# EAGLE design charger (EAGLE 5.11)
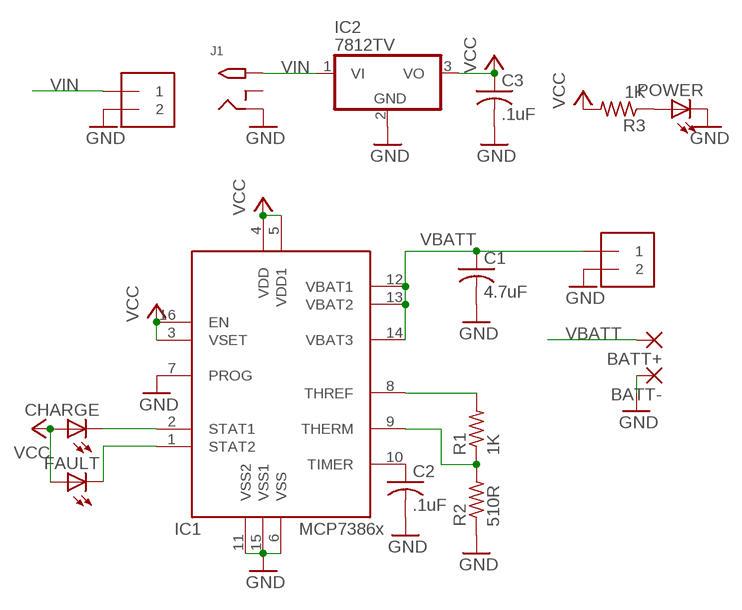
[diagram p0: schematic, sheet 1]

## Parts
BATT  1X2-3.5MM  [1X2-3.5MM]
BATT+  WIREPAD3,81/1,4  [3,81/1,4]
BATT-  WIREPAD3,81/1,4  [3,81/1,4]
C1  4.7uF  C-USC0805K  [C0805K]
C2  .1uF  C-USC0805K  [C0805K]
C3  .1uF  C-USC0805K  [C0805K]
CHARGE  LEDCHIPLED_0805  [CHIPLED_0805]
FAULT  LEDCHIPLED_0805  [CHIPLED_0805]
IC1  MCP7386XS  [SO16]
IC2  7812TV  [TO220V]
J1  2.1MMJACKTHM  [PJ-102A]
POWER  LEDCHIPLED_0805  [CHIPLED_0805]
PWR  1X2-3.5MM  [1X2-3.5MM]
R1  1K  R-US_R0805  [R0805]
R2  510R  R-US_R0805  [R0805]
R3  1K  R-US_R0805  [R0805]

## Nets
GND: BATT-.1(P) BATT.2 C1.2 C2.2 C3.2 IC1.6(VSS) IC1.7(PROG) IC1.11(VSS2) IC1.15(VSS1) IC2.2(GND) J1.RING POWER.C PWR.2 R2.1
N$1: CHARGE.C IC1.2(STAT1)
N$2: C2.1 IC1.10(TIMER)
N$3: FAULT.C IC1.1(STAT2)
N$5: IC1.9(THERM) R1.1 R2.2
N$6: IC1.8(THREF) R1.2
N$7: POWER.A R3.1
VBATT: BATT+.1(P) BATT.1 C1.1 IC1.12(VBAT1) IC1.13(VBAT2) IC1.14(VBAT3)
VCC: C3.1 CHARGE.A FAULT.A IC1.3(VSET) IC1.4(VDD) IC1.5(VDD1) IC1.16(EN) IC2.3(VO) R3.2
VIN: IC2.1(VI) J1.TIP PWR.1
Unconnected: J1.RING_SW

## Library data of the parts
BATT PWR = adafruit:1X2: 3.5mm Terminal block http://www.ladyada.net/library/pcb/eaglelibrary.html
BATT+ BATT- = wirepad:WIREPAD: Wire PAD connect wire on PCB
C1-C3 = adafruit:C-US: CAPACITOR, American symbol
CHARGE FAULT POWER = adafruit:LED: LED OSRAM: - CHIPLED LG R971, LG N971, LY N971, LG Q971, LY Q971, LO R971, LY R971 LH N974, LH R974 LS Q976, LO Q976, LY Q976 LO Q996 - Hyper CHIPLED LW Q18S LB Q993, LB Q99A, LB R99A - SideLED LS A670, LO A670, LY A670, LG A670, LP A670 LB A673, LV A673, LT A673, LW A673 LH A674 LY A675 LS A676, LA A676, LO A676, LY A676, LW A676 LS A679, LY A679, LG A679 - Hyper Micro SIDELED® LS Y876, LA Y876, LO Y876, LY Y876 LT Y87S - SmartLED LW L88C, LW L88S LB L89C, LB L89S, LG L890 LS L89K, LO L89K, LY L89K LS L896, LA L896, LO L896, LY L896 - TOPLED LS T670, LO T670, LY T670, LG T670, LP T670 LSG T670, LSP T670, LSY T670, LOP T670, LYG T670 LG T671, LOG T671, LSG T671 LB T673, LV T673, LT T673, LW T673 LH T674 LS T676, LA T676, LO T676, LY T676, LB T676, LH T676, LSB T676, LW T676 LB T67C, LV T67C, LT T67C, LS T67K, LO T67K, LY T67K, LW E67C LS E67B, LA E67B, LO E67B, LY E67B, LB E67C, LV E67C, LT E67C LW T67C LS T679, LY T679, LG T679 LS T770, LO T770, LY T770, LG T770, LP T770 LB T773, LV T773, LT T773, LW T773 LH T774 LS E675, LA E675, LY E675, LS T675 LS T776, LA T776, LO T776, LY T776, LB T776 LHGB T686 LT T68C, LB T68C - Hyper Mini TOPLED® LB M676 - Mini TOPLED Santana® LG M470 LS M47K, LO M47K, LY M47K Source: http://www.osram.convergy.de/
IC1 = adafruit:MCP7386X: MCP7386x 4.1, 4.2, 8.2, 8.4 LiPoly battery charger chip family, with wide DC input, thermal cutoff, adjustable curret, and indicator LEDs
IC2 = linear:78*: Positive VOLTAGE REGULATOR Source: http://cache.national.com/ds/LM/LM78L05.pdf http://www.fairchildsemi.com/ds/LM/LM7805.pdf
J1 = adafruit:2.1MMJACK: 2.1mm x 5.5mm THM DC jack with internal switch. Digikey part #PJ-102A, 4UCON part #05537 2.1mm x 5.5mm SMT DC jack with internal switch. Digikey part #PJ-002A-SMT, 4UCON part #03267 By microbuilder.eu & adafruit.com
R1-R3 = adafruit:R-US_: RESISTOR, American symbol

## Board
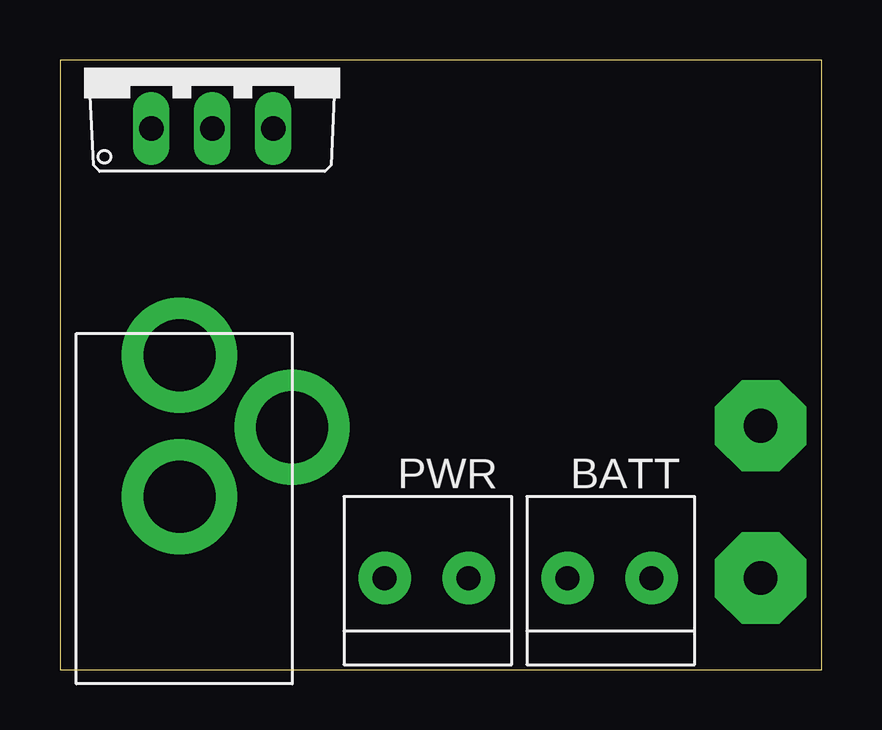
[diagram p1: board, top side]
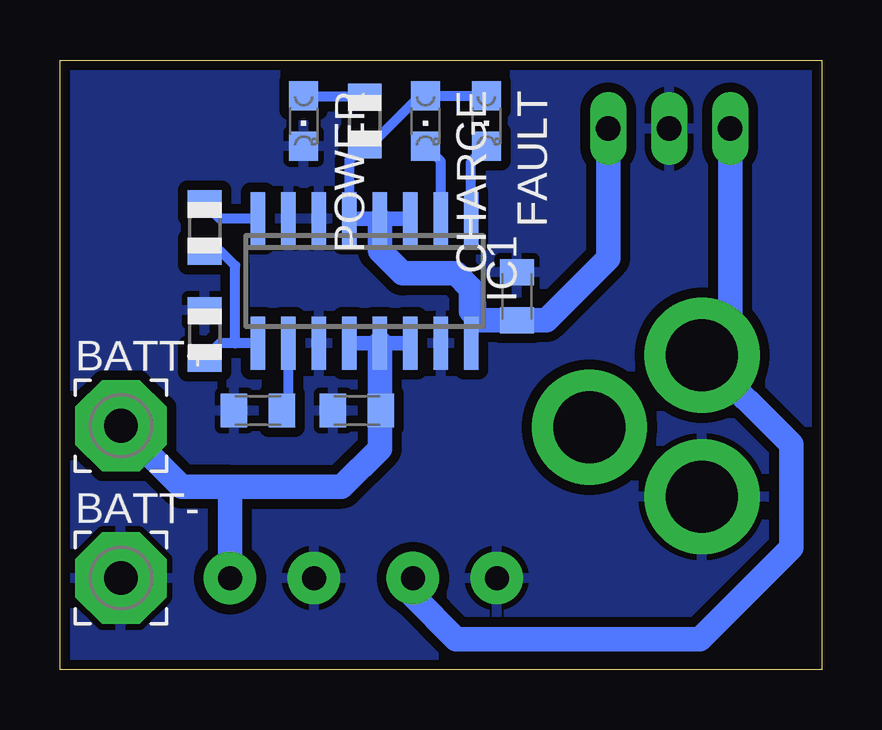
[diagram p2: board, bottom side, seen from below]

Size 31.75 x 25.4 mm. Coordinates in mm from the lower left corner, seen from the top.
Outline: 0,0 31.75,0 31.75,25.4 0,25.4 0,0
Copper layers (1*16): Top 0.035mm / dielectric 1.5mm / Bottom 0.035mm
Design rules "default": minimum track width 12mil, minimum drill 24mil, track to track 8mil, track to pad 8mil, pad to pad 8mil, via to via 8mil, smd to smd 8mil, copper to edge 15mil, drill to drill 8mil, minimum pad ring 10mil, minimum via ring 8mil, stop-mask expansion 4mil, vias tented up to drill 0mil, thermal gap 10mil

### Footprints (pad centres in the part's own frame; a part is rotated, then mirrored left to right if it is on the bottom)
1X2-3.5MM = drill 1 pad 2.184 round: 1 1.8,0; 2 -1.7,0
3,81/1,4 = drill 1.397 pad 3.81 octagon: 1 0,0
C0805K = smd 1.1 x 1.4: 1 -1,0; 2 1,0
CHIPLED_0805 = smd 1.2 x 1.2: A 0,-1.05; C 0,1.05
SO16 = smd 0.6 x 2.2: 1 -4.445,-2.6; 2 -3.175,-2.6; 3 -1.905,-2.6; 4 -0.635,-2.6; 5 0.635,-2.6; 6 1.905,-2.6; 7 3.175,-2.6; 8 4.445,-2.6; 9 4.445,2.6; 10 3.175,2.6; 11 1.905,2.6; 12 0.635,2.6; 13 -0.635,2.6; 14 -1.905,2.6; 15 -3.175,2.6; 16 -4.445,2.6
TO220V = drill 1.016 long: 1 -2.54,-2.54; 2 0,-2.54; 3 2.54,-2.54
PJ-102A = drill 3 pad 4.8 round: RING 0.1,-3.39; RING_SW -4.6,-6.29; TIP 0.1,-9.29
R0805 = smd 1.1 x 1.4: 1 -1,0; 2 1,0

### Placement (x,y rotation side)
BATT  22.86,3.81 0 top
BATT+  29.21,10.16 0 bottom
BATT-  29.21,3.81 0 bottom
C1  19.37,10.79 180 bottom
C2  23.5,10.79 180 bottom
C3  12.7,15.56 90 bottom
CHARGE  16.51,22.86 180 bottom
FAULT  13.97,22.86 180 bottom
IC1  19.05,16.19 180 bottom
IC2  6.35,25.08 0 top
J1  5.08,3.81 180 top
POWER  21.59,22.86 180 bottom
PWR  15.24,3.81 0 top
R1  25.72,18.41 90 bottom
R2  25.72,13.97 270 bottom
R3  19.05,22.86 270 bottom

### Tracks (layer width: path | path; a pad name or v marks a point on that pad's centre or on a via)
GND
  pour Bottom (isolate 0.406): 0,0 31.75,0 31.75,25.4 0,25.4
N$1
  Bottom 0.406: IC1.2 15.88,21.18 CHARGE.C
N$2
  Bottom 0.406: IC1.10 22.23,11.11 22.86,10.48 22.81,10.48 C2.1
N$3
  Bottom 0.406: IC1.1 14.61,21.18 FAULT.C
N$5
  Bottom 0.406: IC1.9 24.45,13.59 | 24.45,13.59 25.09,13.59 R2.2 | R1.1 25.04,17.41 24.45,16.83 24.45,13.59
N$6
  Bottom 0.406: IC1.8 25.09,18.79 R1.2
N$7
  Bottom 0.406: R3.1 21.54,23.86 POWER.A
VBATT
  Bottom 0.61: IC1.12 IC1.13 IC1.14
  Bottom 1.016: 18.41,10.84 IC1.13 | 18.41,10.84 C1.1 | 18.41,10.84 18.41,9.21 20,7.62 24.77,7.62 | 24.77,7.62 26.67,7.62 BATT+.1 | BATT.1 24.66,7.51 24.77,7.62
VCC
  Bottom 0.406: FAULT.A CHARGE.A 16.73,23.91 18.73,21.91 19,21.91 R3.2 19.68,21.23 IC1.5
  Bottom 0.61: IC1.5 IC1.4 IC1.3 18.36,18.79 18.41,18.73 | 14.61,14.92 IC1.16 | 14.29,14.61 14.29,15.24 14.61,15.88
  Bottom 1.016: 18.41,18.73 18.41,17.46 17.46,16.51 15.24,16.51 14.61,15.88 14.61,14.92 | 14.29,14.61 14.24,14.56 C3.1 11.48,14.56 8.89,17.14 IC2.3
VIN
  Bottom 1.016: IC2.1 3.81,14.27 J1.TIP 1.27,9.39 1.27,5.08 5.08,1.27 15.24,1.27 17.04,3.07 PWR.1